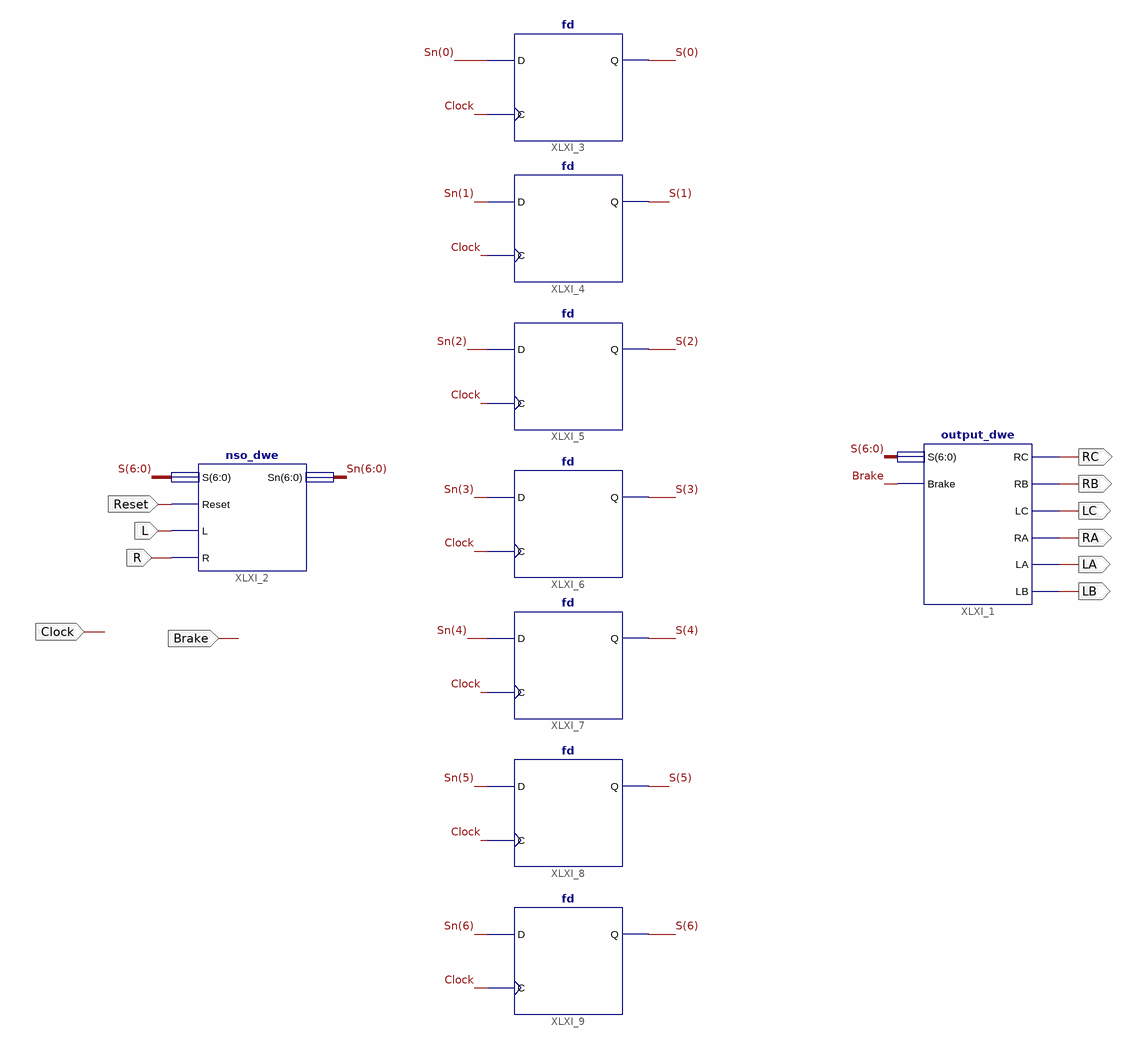
[diagram p0: schematic sheet 1]
// Xilinx ISE schematic final_top_dwe.sch (spartan3) as structural Verilog: 9 symbols, 11 ports
module final_top_dwe (
  input  L,
  input  R,
  input  Reset,
  input  Clock,
  input  Brake,
  output RC,
  output RB,
  output LC,
  output RA,
  output LA,
  output LB
);

  wire [6:0] S, Sn;

  output_dwe XLXI_1 (.Brake(Brake), .LA(LA), .LB(LB), .LC(LC), .RA(RA), .RB(RB), .RC(RC), .S(S));
  nso_dwe XLXI_2 (.L(L), .R(R), .Reset(Reset), .S(S), .Sn(Sn));
  fd XLXI_3 (.C(Clock), .D(Sn[0]), .Q(S[0]));
  fd XLXI_4 (.C(Clock), .D(Sn[1]), .Q(S[1]));
  fd XLXI_5 (.C(Clock), .D(Sn[2]), .Q(S[2]));
  fd XLXI_6 (.C(Clock), .D(Sn[3]), .Q(S[3]));
  fd XLXI_8 (.C(Clock), .D(Sn[5]), .Q(S[5]));
  fd XLXI_9 (.C(Clock), .D(Sn[6]), .Q(S[6]));
  fd XLXI_7 (.C(Clock), .D(Sn[4]), .Q(S[4]));
endmodule
